# EAGLE schematic coupling (EAGLE 7.3.0)
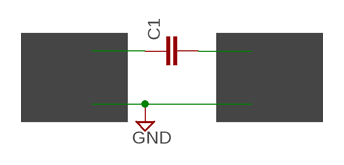
[diagram p0: schematic, sheet 1]

## Parts
C1  C5/2.5  [C5B2.5]

## Nets
N$1: C1.1
N$2: C1.2

## Notes on the sheet
- Circuit A | Circuit B

## Library data of the parts
C1 = capacitor-wima:C: CAPACITOR naming: grid - package width